# EAGLE design mic_sensor_arduino (EAGLE 9.6.2)
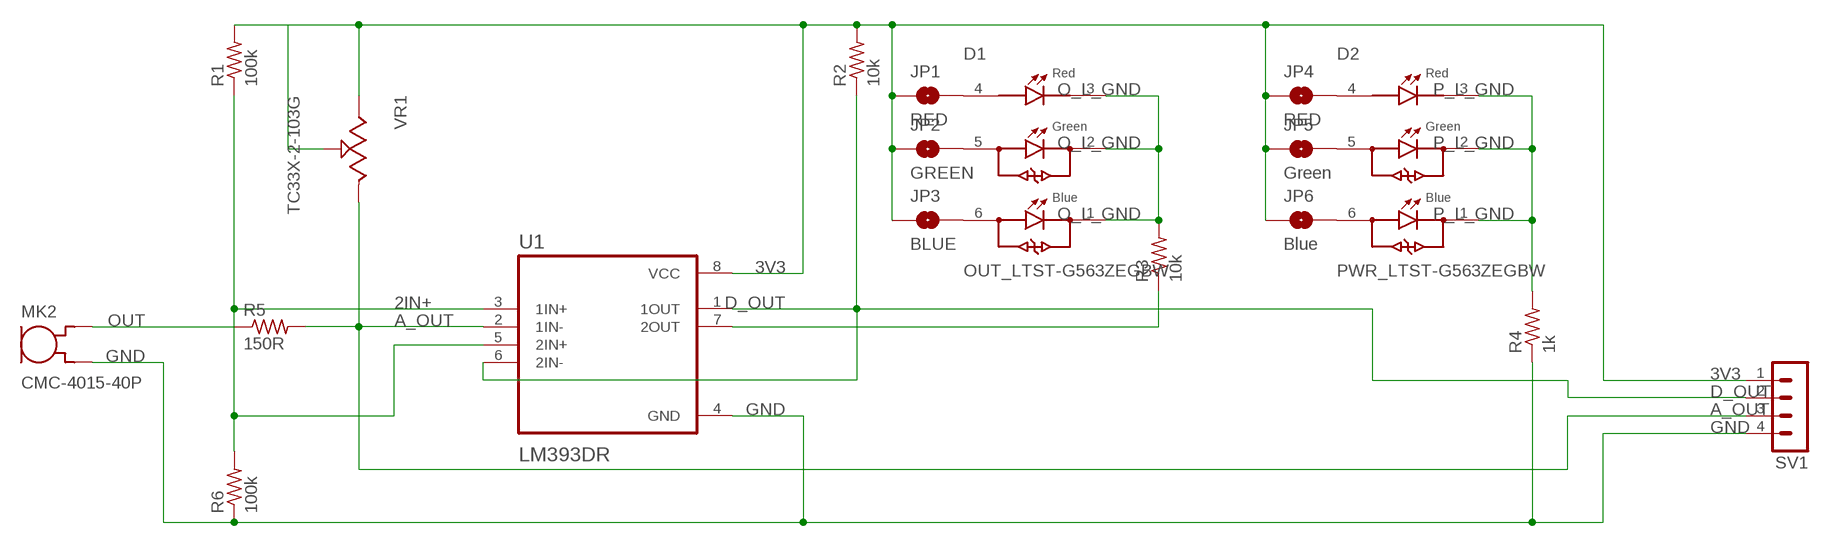
[diagram p0: schematic, sheet 1]

## Parts
D1  OUT_LTST-G563ZEGBW  LTST-G563ZEGBW  [LED_LTST-G563ZEGBW]
D2  PWR_LTST-G563ZEGBW  LTST-G563ZEGBW  [LED_LTST-G563ZEGBW]
JP1  RED  JUMPER-SMT_2_NO_SILK  [SMT-JUMPER_2_NO_SILK]
JP2  GREEN  JUMPER-SMT_2_NO_SILK  [SMT-JUMPER_2_NO_SILK]
JP3  BLUE  JUMPER-SMT_2_NO_SILK  [SMT-JUMPER_2_NO_SILK]
JP4  RED  JUMPER-SMT_2_NO_SILK  [SMT-JUMPER_2_NO_SILK]
JP5  Green  JUMPER-SMT_2_NO_SILK  [SMT-JUMPER_2_NO_SILK]
JP6  Blue  JUMPER-SMT_2_NO_SILK  [SMT-JUMPER_2_NO_SILK]
MK2  CMC-4015-40P  [MIC_CMC-4015-40P]
R1  100k  R-US_R0603  [R0603]
R2  10k  R-US_R0603  [R0603]
R3  10k  R-US_R0603  [R0603]
R4  1k  R-US_R0603  [R0603]
R5  150R  R-US_R0603  [R0603]
R6  100k  R-US_R0603  [R0603]
SV1  MA04-1  [MA04-1]
U1  LM393DR  [SOIC127P599X175-8N]
VR1  TC33X-2-103G  [TRIMMER_TC33X-2-103G]

## Nets
2IN+: R1.1 R6.2 U1.3(1IN+) U1.5(2IN+)
2OUT: R3.1 U1.7(2OUT)
3V3: JP1.1 JP2.1 JP3.1 JP4.1 JP5.1 JP6.1 R1.2 R2.2 SV1.1 U1.8(VCC) VR1.1(CCW) VR1.2(WIPER)
A_OUT: R5.2 SV1.3 U1.2(1IN-) VR1.3(CW)
D_OUT: R2.1 SV1.2 U1.1(1OUT) U1.6(2IN-)
GND: MK2.M(GND) R4.1 R6.1 SV1.4 U1.4(GND)
N$1: D1.4 JP1.2
N$2: D1.5 JP2.2
N$5: D1.6 JP3.2
N$6: D2.4 JP4.2
N$7: D2.5 JP5.2
N$8: D2.6 JP6.2
O_L_GND: D1.1 D1.2 D1.3 R3.2
OUT: MK2.P(OUT) R5.1
P_L_GND: D2.1 D2.2 D2.3 R4.2

## Library data of the parts
D1 D2 = LTST-G563ZEGBW:LTST-G563ZEGBW: LED; SMD; 5050, PLCC6; RGB; 5x5x1.6mm; 120°; 20mA; Lens: transparent Check availability <https://pricing.snapeda.com/parts/LTST-G563ZEGBW/Lite-On/view-part?ref=eda>; AVAILABILITY: Not in stock; CHECK_PRICES: https://www.snapeda.com/parts/LTST-G563ZEGBW/Lite-On/view-part/?ref=eda; DESCRIPTION: LED; SMD; 5050, PLCC6; RGB; 5x5x1.6mm; 120°; 20mA; Lens: transparent; MF: Lite-On; MP: LTST-G563ZEGBW; PACKAGE: PLCC-6 Lite-On; PRICE: None; SNAPEDA_LINK: https://www.snapeda.com/parts/LTST-G563ZEGBW/Lite-On/view-part/?ref=snap
JP1-JP6 = SparkFun-Jumpers:JUMPER-SMT_2_NO: Normally open jumper This jumper has two pads in close proximity to each other. Apply solder to close the connection. Round pads are easier to solder for beginners, but are a lot larger. SparkFun Product that uses the round pads: SparkFun EL Sequencer <https://www.sparkfun.com/products/12781>
MK2 = CMC-4015-40P:CMC-4015-40P: CMC Series Ø4 x 1.5 mm 58 dB 10 V Omnidirectional Electret Condenser Microphone Check availability <https://pricing.snapeda.com/parts/CMC-4015-40P/CUI%20Devices/view-part?ref=eda>; AVAILABILITY: In Stock; CHECK_PRICES: https://www.snapeda.com/parts/CMC-4015-40P/CUI+Devices/view-part/?ref=eda; CUI_PURCHASE_URL: https://www.cuidevices.com/product/audio/microphones/electret-condenser-microphones/cmc-4015-40p?utm_source=snapeda.com&utm_medium=referral&utm_campaign=snapedaBOM; DESCRIPTION: 4.0 mm, Omnidirectional, PCB Mount, 2.0 Vdc, Electret Condenser Microphone; MF: CUI Devices; MP: CMC-4015-40P; PACKAGE: None; PRICE: None; PURCHASE-URL: https://www.snapeda.com/api/url_track_click_mouser/?unipart_id=1814008&manufacturer=CUI Devices&part_name=CMC-4015-40P&search_term=cmc-4015-40p; SNAPEDA_LINK: https://www.snapeda.com/parts/CMC-4015-40P/CUI+Devices/view-part/?ref=snap
R1-R6 = resistor:R-US_: RESISTOR, American symbol
SV1 = con-lstb:MA04-1: PIN HEADER; OC_FARNELL: unknown; OC_NEWARK: unknown
U1 = LM393DR:LM393DR: Check availability <https://pricing.snapeda.com/parts/LM393DR/Texas%20Instruments/view-part?ref=eda>; AVAILABILITY: In Stock; CHECK_PRICES: https://www.snapeda.com/parts/LM393DR/Texas+Instruments/view-part/?ref=eda; DESCRIPTION: Dual differential comparator, commercial grade; MF: Texas Instruments; MP: LM393DR; PACKAGE: SOIC-8 Texas Instruments; PRICE: None; PURCHASE-URL: https://www.snapeda.com/api/url_track_click_mouser/?unipart_id=6437&manufacturer=Texas Instruments&part_name=LM393DR&search_term=lm393dr; SNAPEDA_LINK: https://www.snapeda.com/parts/LM393DR/Texas+Instruments/view-part/?ref=snap
VR1 = TC33X-2-103G:TC33X-2-103G: Res Trimmer 10K Ohm 25% 1/10W 1(Elec)/1(Mech)Turn (3 X 3.8mm) Foot Print SMD Embossed T/R Check availability <https://pricing.snapeda.com/parts/TC33X-2-103G/Bourns/view-part?ref=eda>; AVAILABILITY: In Stock; CHECK_PRICES: https://www.snapeda.com/parts/TC33X-2-103G/Bourns/view-part/?ref=eda; DESCRIPTION: 10 kOhms 0.1W, 1/10W J Lead Surface Mount Trimmer Potentiometer Cermet 1.0 Turn Top Adjustment; MF: Bourns; MP: TC33X-2-103G; PACKAGE: SOD-23 Bourns; PRICE: None; PURCHASE-URL: https://www.snapeda.com/api/url_track_click_mouser/?unipart_id=1475438&manufacturer=Bourns&part_name=TC33X-2-103G&search_term=potentiometer smd; SNAPEDA_LINK: https://www.snapeda.com/parts/TC33X-2-103G/Bourns/view-part/?ref=snap

## Board
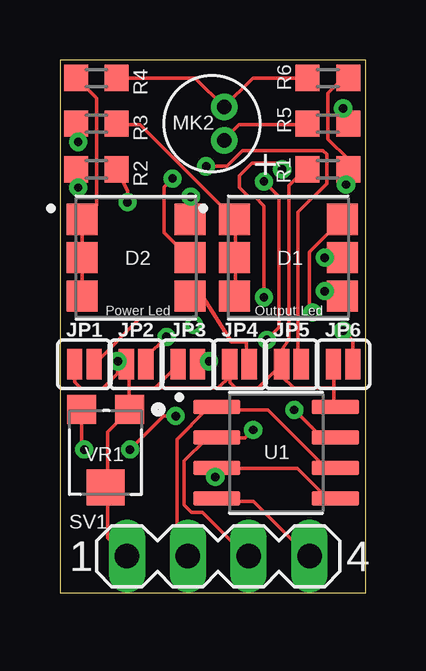
[diagram p1: board, top side]
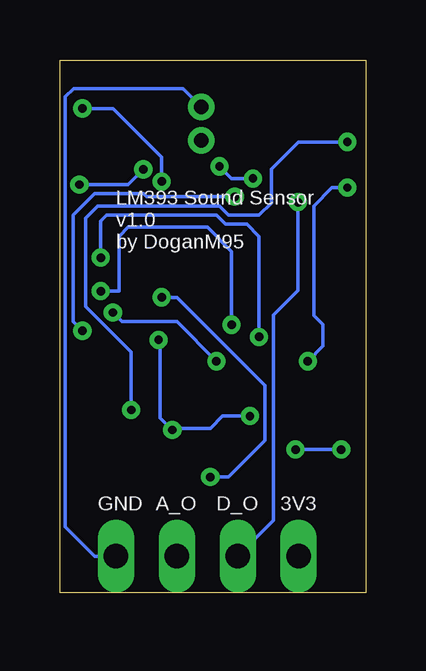
[diagram p2: board, bottom side, seen from below]

Size 12.75 x 22.21 mm. Coordinates in mm from the lower left corner, seen from the top.
Outline: 0,0 12.75,0 12.75,22.21 0,22.21 0,0
Copper layers (1*16): Top 0.035mm / dielectric 1.5mm / Bottom 0.035mm
Design rules "default *": minimum track width 6mil, minimum drill 0.35mm, track to track 6mil, track to pad 6mil, pad to pad 6mil, via to via 6mil, smd to smd 6mil, copper to edge 40mil, drill to drill 6mil, minimum pad ring 10mil, minimum via ring 8mil, stop-mask expansion 4mil, vias tented up to drill 20mil, thermal gap 10mil

### Footprints (pad centres in the part's own frame; a part is rotated, then mirrored left to right if it is on the bottom)
LED_LTST-G563ZEGBW = smd 1.3 x 1.3: 1 -2.25,1.6; 2 -2.25,0; 3 -2.25,-1.6; 4 2.25,-1.6; 5 2.25,0; 6 2.25,1.6
SMT-JUMPER_2_NO_SILK = smd 0.635 x 1.27: 1 -0.406,0; 2 0.406,0
MIC_CMC-4015-40P = drill 0.6: M 0.5,0.7; P 0.5,-0.7
R0603 = smd 1 x 1.1: 1 -0.85,0; 2 0.85,0
MA04-1 = drill 1.016 long: 1 -3.81,0; 2 -1.27,0; 3 1.27,0; 4 3.81,0
SOIC127P599X175-8N = smd 1.97 x 0.6: 1 -2.47,1.905; 2 -2.47,0.635; 3 -2.47,-0.635; 4 -2.47,-1.905; 5 2.47,-1.905; 6 2.47,-0.635; 7 2.47,0.635; 8 2.47,1.905
TRIMMER_TC33X-2-103G = smd 1.2 x 1.2: 1 -1,-1.8; 3 1,-1.8 | smd 1.6 x 1.5: 2 0,1.45

### Placement (x,y rotation side)
D1  9.53,13.97 0 top
D2  3.17,13.97 0 top
JP1  1.02,9.53 0 top
JP2  3.17,9.53 0 top
JP3  5.33,9.53 0 top
JP4  7.49,9.53 0 top
JP5  9.65,9.53 0 top
JP6  11.81,9.53 0 top
MK2  6.35,19.56 0 top
R1  11.18,17.65 180 top
R2  1.52,17.65 180 top
R3  1.52,19.56 0 top
R4  1.52,21.46 180 top
R5  11.18,19.56 0 top
R6  11.18,21.46 0 top
SV1  6.6,1.52 0 top
U1  9.02,5.84 0 top
VR1  1.91,5.84 180 top

### Tracks (layer width: path | path; a pad name or v marks a point on that pad's centre or on a via)
2IN+  (via drill 0.35)
  Top 0.152: 6.55,5.18 9.91,5.18 11.12,3.96 11.43,3.96 U1.5 | 6.55,5.18 U1.3 | R6.2 11.81,21.46 11.18,20.83 11.18,18.92 12.03,18.07 R1.1 12.03,17.11 v11.94,17.02 | v9.27,17.65 9.02,17.91 8,17.91 7.49,17.4 7.49,16.89 7.87,16.51 8.13,16.51 8.51,16.13 v8.51,12.32 | v6.48,4.83 6.48,5.11 6.55,5.18
  Bottom 0.152: v11.94,17.02 9.91,17.02 v9.27,17.65 | v8.51,12.32 7.87,12.32 4.19,8.64 4.19,6.35 5.71,4.83 v6.48,4.83
2OUT  (via drill 0.35)
  Top 0.152: U1.7 10.92,6.48 v9.78,7.62 | v0.76,18.8 0.67,18.88 R3.1
  Bottom 0.152: v9.78,7.62 9.78,10.03 11.68,11.94 11.68,15.62 11.18,16.13 6.1,16.13 5.71,15.75 4.45,15.75 3.94,16.26 3.94,17.65 2.79,18.8 v0.76,18.8
3V3  (via drill 0.35)
  Top 0.152: SV1.1 2.74,1.52 1.98,2.29 1.98,4.27 VR1.2 1.98,4.42 1.98,6.71 2.9,7.62 VR1.1 2.9,7.77 2.9,8.53 | 2.9,8.53 2.9,9.45 JP2.1 2.64,9.65 v2.41,9.65 2.41,9.14 1.78,8.51 0.89,8.51 0.61,8.79 JP1.1 | 3.96,8.53 4.88,9.45 JP3.1 | 2.9,8.53 3.96,8.53 | 3.96,8.53 6.6,8.53 7.09,9.02 JP4.1 7.09,8.76 7.32,8.53 8.26,8.53 JP5.1 | 11.43,8.53 11.43,7.77 U1.8 | 11.43,8.53 11.43,9.45 JP6.1 | R1.2 10.24,17.65 9.55,16.97 9.55,10.55 9.25,10.1 JP5.1 | 11.43,8.53 9.75,8.53 9.25,9.04 JP5.1 | R2.2 0.67,16.98 v0.76,16.89
  Bottom 0.152: v0.76,16.89 1.4,16.89 2.16,16.13 2.16,11.56 1.78,11.18 1.78,10.29 v2.41,9.65
A_OUT  (via drill 0.35)
  Top 0.152: 6.49,6.45 6.4,6.4 6.1,6.4 5.18,5.49 5.18,3.66 5.49,3.35 5.94,3.35 7.77,1.52 SV1.3 | 6.49,6.45 U1.2 | VR1.3 0.91,6.08 v1.02,5.97 | v2.92,5.97 4.32,7.37 v4.83,7.37 | v8.06,6.79 7.72,6.45 6.49,6.45 | v8.64,10.54 9.14,11.05 9.14,16.51 v8.51,17.14 | v11.81,20.19 12.03,19.98 R5.2
  Bottom 0.152: v1.02,5.97 v2.92,5.97 | v4.83,7.37 5.97,7.37 6.48,6.86 8.06,6.86 v8.06,6.79 8.57,7.3 8.57,10.48 v8.64,10.54 | v8.51,17.14 8.51,18.16 10.54,20.19 v11.81,20.19
D_OUT  (via drill 0.35)
  Top 0.152: U1.6 11.43,5.33 10.97,5.33 8.69,7.62 6.55,7.62 U1.1 6.4,7.62 6.1,7.62 4.88,6.4 4.88,1.98 SV1.2 | v2.82,16.28 2.82,16.77 R2.1
  Bottom 0.152: v2.82,16.28 2.82,12.6 3.83,11.58 3.83,3.02 SV1.2
GND
  Top 0.152: U1.4 6.55,3.81 8.08,3.81 10.36,1.52 SV1.4 | R6.1 8.05,21.46 MK2.M 5.64,21.46 R4.1
  Bottom 0.152: MK2.M 7.61,21.02 12.18,21.02 12.52,20.68 12.52,2.74 11.3,1.52 SV1.4
N$1  (via drill 0.35)
  Top 0.152: JP1.2 3.33,11.43 5.33,11.43 v5.59,11.18 | 11.78,11.9 D1.4 11.57,12.57 v11.05,12.57
  Bottom 0.152: v5.59,11.18 5.59,14.22 6.6,15.24 9.91,15.24 10.29,14.86 10.29,12.57 v11.05,12.57
N$2  (via drill 0.35)
  Top 0.152: v11.05,13.97 11.18,13.84 11.65,13.84 D1.5 | v4.45,10.67 3.58,9.8 JP2.2
  Bottom 0.152: v11.05,13.97 11.05,15.49 10.79,15.75 6.22,15.75 5.84,15.37 4.95,15.37 4.45,14.86 v4.45,10.67
N$5  (via drill 0.35)
  Top 0.152: D1.6 10.41,14.21 10.41,11.81 v10.54,11.68 | v6.22,9.65 5.87,9.65 JP3.2
  Bottom 0.152: v10.54,11.68 10.16,11.3 7.87,11.3 v6.22,9.65
N$6
  Top 0.152: JP4.2 7.77,9.6 7.77,10.46 7.16,10.46 5.97,12.33 5.99,12.37 D2.4
N$7  (via drill 0.35)
  Top 0.152: JP5.2 9.93,9.65 9.93,15.88 11.12,17.07 11.12,18.29 10.97,18.44 7.62,18.44 6.96,17.78 v6.1,17.78 | D2.5 5.33,14.02 4.34,15.01 4.34,16.92 v4.7,17.27
  Bottom 0.152: v6.1,17.78 5.59,17.27 v4.7,17.27
N$8  (via drill 0.35)
  Top 0.152: JP6.2 12.22,10.52 v11.81,10.92 | v5.46,16.51 5.42,16.47 D2.6
  Bottom 0.152: v11.81,10.92 12.19,11.3 12.19,15.75 11.3,16.64 9.27,16.64 9.14,16.51 v5.46,16.51
O_L_GND
  Top 0.152: D1.3 7.32,12.5 7.32,13.87 D1.2 7.32,14.02 7.32,15.54 D1.1 7.16,15.7 3.35,19.51 2.44,19.51 R3.2
OUT
  Top 0.152: R5.1 10.21,19.51 7.47,19.51 6.86,18.9 MK2.P
P_L_GND
  Top 0.152: R4.2 1.52,20.61 1.52,16.17 D2.1 D2.2 D2.3

### Text on the board
tNames: Power Led | Output Led
bNames: LM393 Sound Sensor / v1.0 / by DoganM95 | 3V3 | D_O | A_O | GND